# EAGLE design goodthopter10 (EAGLE 6.1)
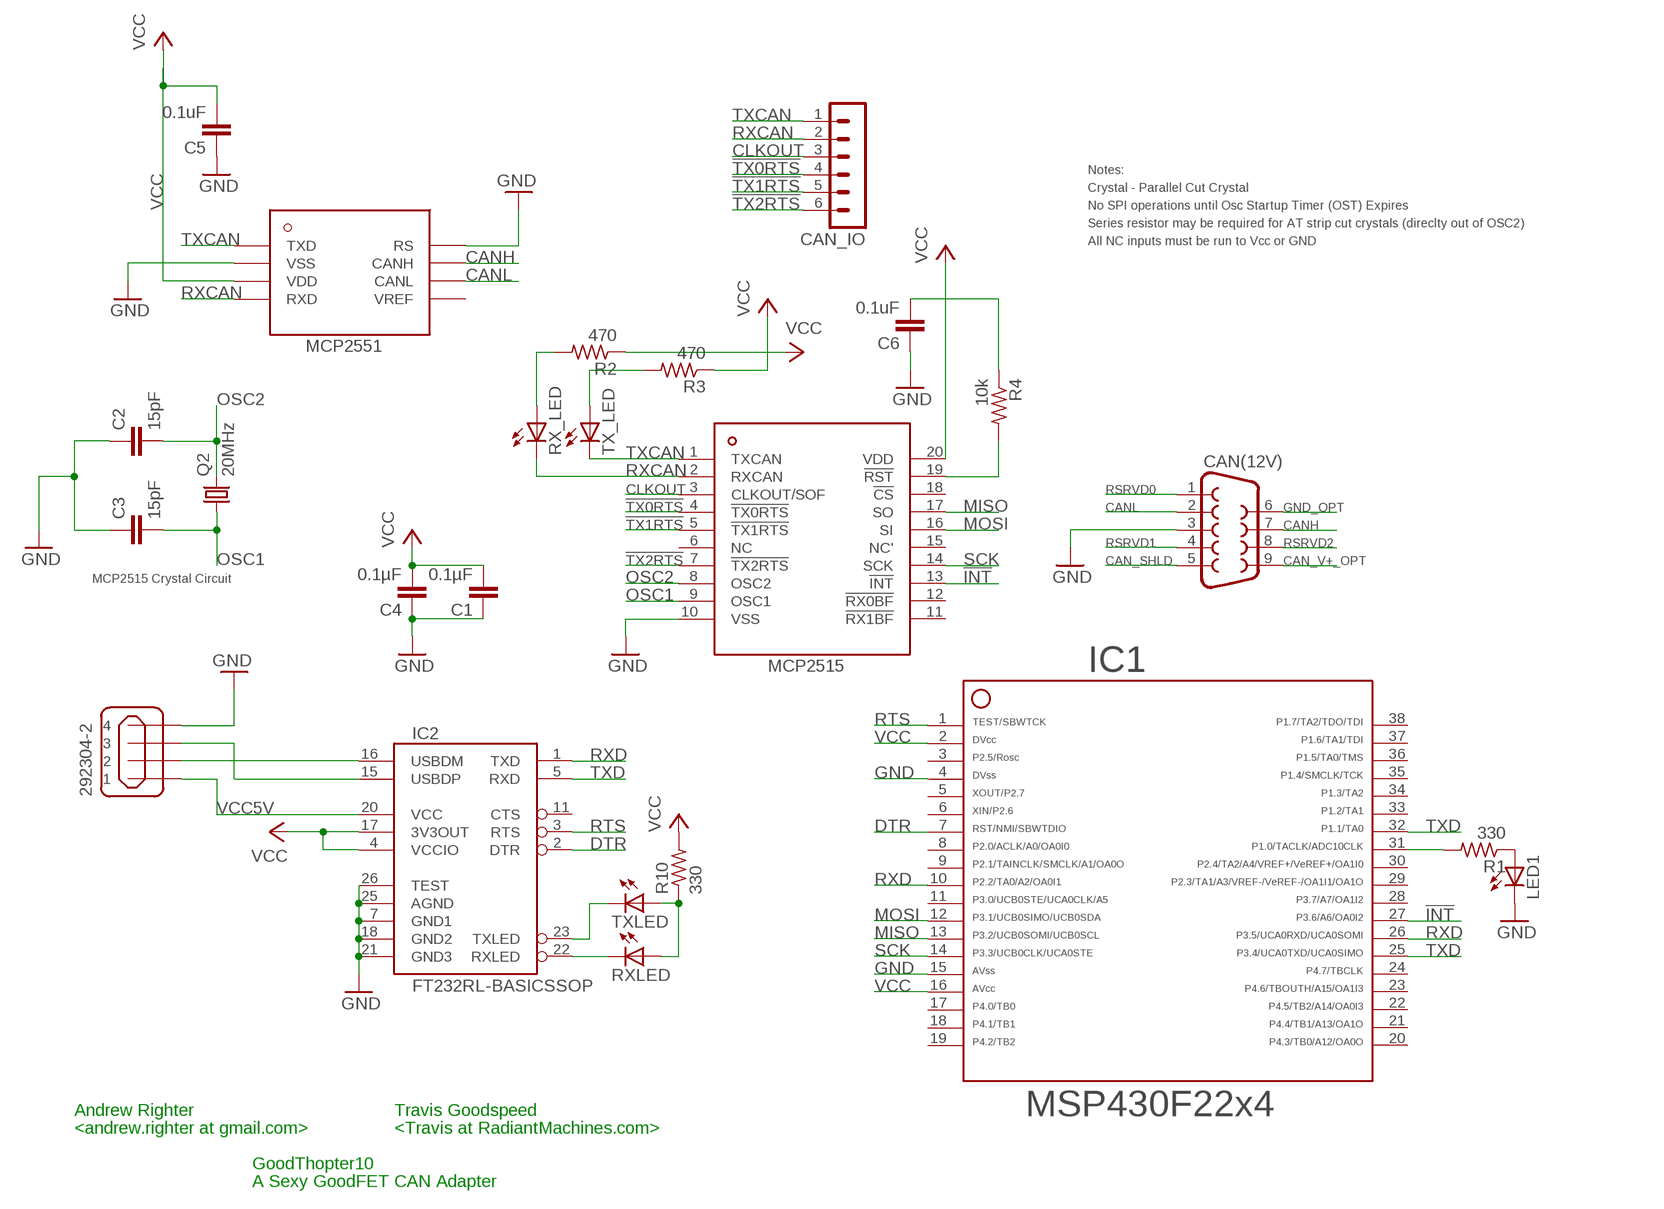
[diagram p0: schematic, sheet 1]

## Parts
292304-2  MINI-USB_4P-292304-2  [85-32004-10X]
C1  0.1µF  C-EUC0603  [C0603]
C2  15pF  C-EUC0603  [C0603]
C3  15pF  C-EUC0603  [C0603]
C4  0.1µF  C-EUC0603  [C0603]
C5  0.1uF  C-EUC0603  [C0603]
C6  0.1uF  C-EUC0603  [C0603]
CAN(12V)  DB9MALE  [DB9_MALE]
CAN_IO  MA06-1  [MA06-1]
IC1  F22X4---DA38  [DA38]
IC2  FT232RL-BASICSSOP  [SSOP28DB]
LED1  LEDCHIP-LED0603  [CHIP-LED0603]
Q2  20MHz  CRYSTALHC49UP  [HC49UP]
R1  330  R-US_R0603  [R0603]
R2  470  R-US_R0603  [R0603]
R3  470  R-US_R0603  [R0603]
R4  10k  R-US_R0603  [R0603]
R10  330  R-US_R0603  [R0603]
RX_LED  LEDCHIP-LED0603  [CHIP-LED0603]
RXLED  LEDCHIP-LED0603  [CHIP-LED0603]
TX_LED  LEDCHIP-LED0603  [CHIP-LED0603]
TXLED  LEDCHIP-LED0603  [CHIP-LED0603]
U$1  MCP2515  [TSSOP20]
U$2  MCP2551  [SOIC-8]

## Nets
!INT: IC1.27 U$1.13(!INT)
!TX0RTS: CAN_IO.4 U$1.4(!TX0RTS)
!TX1RTS: CAN_IO.5 U$1.5(!TX1RTS)
!TX2RTS: CAN_IO.6 U$1.7(!TX2RTS)
CAN_SHLD: CAN(12V).5
CAN_V+_OPT: CAN(12V).9
CANH: CAN(12V).7 U$2.CANH
CANL: CAN(12V).2 U$2.CANL
CLKOUT: CAN_IO.3 U$1.3(CLKOUT/SOF)
DTR: IC1.7 IC2.2(DTR)
GND: 292304-2.4 C1.1 C2.1 C3.1 C4.1 C5.1 C6.1 CAN(12V).3 IC1.4 IC1.15 IC2.7(GND1) IC2.18(GND2) IC2.21(GND3) IC2.25(AGND) IC2.26(TEST) LED1.C U$1.10(VSS) U$2.RS U$2.VSS
GND_OPT: CAN(12V).6
MISO: IC1.13 U$1.17(SO)
MOSI: IC1.12 U$1.16(SI)
N$1: R2.2 RX_LED.A
N$2: R3.2 TX_LED.A
N$3: 292304-2.3 IC2.15(USBDP)
N$4: 292304-2.2 IC2.16(USBDM)
N$5: R4.2 U$1.19(!RST)
N$6: IC2.22(RXLED) RXLED.C
N$7: IC2.23(TXLED) TXLED.C
N$8: R10.1 RXLED.A TXLED.A
N$9: IC1.31 R1.2
N$10: LED1.A R1.1
N$11: C6.2 R4.1
OSC1: C3.2 Q2.1 U$1.9(OSC1)
OSC2: C2.2 Q2.2 U$1.8(OSC2)
RSRVD0: CAN(12V).1
RSRVD1: CAN(12V).4
RSRVD2: CAN(12V).8
RTS: IC1.1 IC2.3(RTS)
RXCAN: CAN_IO.2 RX_LED.C U$1.2(RXCAN) U$2.RXD
RXD: IC1.10 IC1.26 IC2.1(TXD)
SCK: IC1.14 U$1.14(SCK)
TXCAN: CAN_IO.1 TX_LED.C U$1.1(TXCAN) U$2.TXD
TXD: IC1.25 IC1.32 IC2.5(RXD)
VCC: C1.2 C4.2 C5.2 IC1.2 IC1.16 IC2.4(VCCIO) IC2.17(3V3OUT) R2.1 R3.1 R10.2 U$1.20(VDD) U$2.VDD
VCC5V: 292304-2.1 IC2.20(VCC)
Unconnected: IC1.3 IC1.5 IC1.6 IC1.8 IC1.9 IC1.11 IC1.17 IC1.18 IC1.19 IC1.20 IC1.21 IC1.22 IC1.23 IC1.24 IC1.28 IC1.29 IC1.30 IC1.33 IC1.34 IC1.35 IC1.36 IC1.37 IC1.38 IC2.11(CTS) U$1.6(NC) U$1.11(!RX1BF) U$1.12(!RX0BF) U$1.15(NC') U$1.18(!CS) U$2.VREF

## Notes on the sheet
- Notes:
- Crystal - Parallel Cut Crystal
- No SPI operations until Osc Startup Timer (OST) Expires
- Series resistor may be required for AT strip cut crystals (direclty out of OSC2)
- All NC inputs must be run to Vcc or GND
- MCP2515 Crystal Circuit
- 292304-2
- Andrew Righter | Travis Goodspeed
- <andrew.righter at gmail.com> | <Travis at RadiantMachines.com>
- GoodThopter10
- A Sexy GoodFET CAN Adapter

## Library data of the parts
292304-2 = USB-TYPE-B:MINI-USB_4P-: MINI USB 4 Pol. Source: www.cypressindustries.com; OC_FARNELL: unknown; OC_NEWARK: unknown
C1-C6 = rcl:C-EU: CAPACITOR, European symbol
CAN(12V) = SparkFun-Connectors:DB9: DB9 Connector Standard DB9 (D-Sub 9) serial connector. Can be used for CAN bus as well as RS485 and RS232. Footprint production proven. Spark Fun Electronics SKU : PRT-00429
CAN_IO = con-lstb:MA06-1: PIN HEADER; OC_FARNELL: unknown; OC_NEWARK: unknown
IC1 = TI_MSP430_v13:F22X4---DA38: ***MSP430F22x4***DA38
IC2 = SparkFun:FT232RL-BASIC: USB UART This is the simplified version of the FT232RL unit. Only what you need, nothing you don't. Spark Fun Electronics SKU : COM-00650
LED1 RX_LED RXLED TX_LED TXLED = led:LED: LED OSRAM: - CHIPLED LG R971, LG N971, LY N971, LG Q971, LY Q971, LO R971, LY R971 LH N974, LH R974 LS Q976, LO Q976, LY Q976 LO Q996 - Hyper CHIPLED LW Q18S LB Q993, LB Q99A, LB R99A - SideLED LS A670, LO A670, LY A670, LG A670, LP A670 LB A673, LV A673, LT A673, LW A673 LH A674 LY A675 LS A676, LA A676, LO A676, LY A676, LW A676 LS A679, LY A679, LG A679 - Hyper Micro SIDELED® LS Y876, LA Y876, LO Y876, LY Y876 LT Y87S - SmartLED LW L88C, LW L88S LB L89C, LB L89S, LG L890 LS L89K, LO L89K, LY L89K LS L896, LA L896, LO L896, LY L896 - TOPLED LS T670, LO T670, LY T670, LG T670, LP T670 LSG T670, LSP T670, LSY T670, LOP T670, LYG T670 LG T671, LOG T671, LSG T671 LB T673, LV T673, LT T673, LW T673 LH T674 LS T676, LA T676, LO T676, LY T676, LB T676, LH T676, LSB T676, LW T676 LB T67C, LV T67C, LT T67C, LS T67K, LO T67K, LY T67K, LW E67C LS E67B, LA E67B, LO E67B, LY E67B, LB E67C, LV E67C, LT E67C LW T67C LS T679, LY T679, LG T679 LS T770, LO T770, LY T770, LG T770, LP T770 LB T773, LV T773, LT T773, LW T773 LH T774 LS E675, LA E675, LY E675, LS T675 LS T776, LA T776, LO T776, LY T776, LB T776 LHGB T686 LT T68C, LB T68C - Hyper Mini TOPLED® LB M676 - Mini TOPLED Santana® LG M470 LS M47K, LO M47K, LY M47K Source: http://www.osram.convergy.de LUXEON: - LUMILED® LXK2-PW12-R00, LXK2-PW12-S00, LXK2-PW14-U00, LXK2-PW14-V00 LXK2-PM12-R00, LXK2-PM12-S00, LXK2-PM14-U00 LXK2-PE12-Q00, LXK2-PE12-R00, LXK2-PE12-S00, LXK2-PE14-T00, LXK2-PE14-U00 LXK2-PB12-K00, LXK2-PB12-L00, LXK2-PB12-M00, LXK2-PB14-N00, LXK2-PB14-P00, LXK2-PB14-Q00 LXK2-PR12-L00, LXK2-PR12-M00, LXK2-PR14-Q00, LXK2-PR14-R00 LXK2-PD12-Q00, LXK2-PD12-R00, LXK2-PD12-S00 LXK2-PH12-R00, LXK2-PH12-S00 LXK2-PL12-P00, LXK2-PL12-Q00, LXK2-PL12-R00 Source: www.luxeon.com KINGBRIGHT: KA-3528ASYC Source: www.kingbright.com
Q2 = crystal:CRYSTAL: CRYSTAL; OC_FARNELL: unknown; OC_NEWARK: unknown
R1-R4 R10 = rcl:R-US_: RESISTOR, American symbol
U$1 = MCP2515:MCP2515: Microchip Technology’s MCP2515 is a stand-alone Controller Area Network (CAN) controller that implements the CAN specification, version 2.0B. It is capable of transmitting and receiving both standard and extended data and remote frames. The MCP2515 has two acceptance masks and six acceptance filters that are used to filter out unwanted messages, thereby reducing the host MCUs overhead. The MCP2515 interfaces with microcontrollers (MCUs) via an industry standard Serial Peripheral Interface (SPI).
U$2 = MCP2551:MCP2551: The MCP2551 is a high-speed CAN, fault-tolerant device that serves as the interface between a CAN protocol controller and the physical bus. The MCP2551 provides differential transmit and receive capability for the CAN protocol controller and is fully compatible with the ISO-11898 standard, including 24V requirements. It will operate at speeds of up to 1 Mb/s. Typically, each node in a CAN system must have a device to convert the digital signals generated by a CAN controller to signals suitable for transmission over the bus cabling (differential output). It also provides a buffer between the CAN controller and the high-voltage spikes that can be generated on the CAN bus by outside sources (EMI, ESD, electrical transients, etc.).

## Board
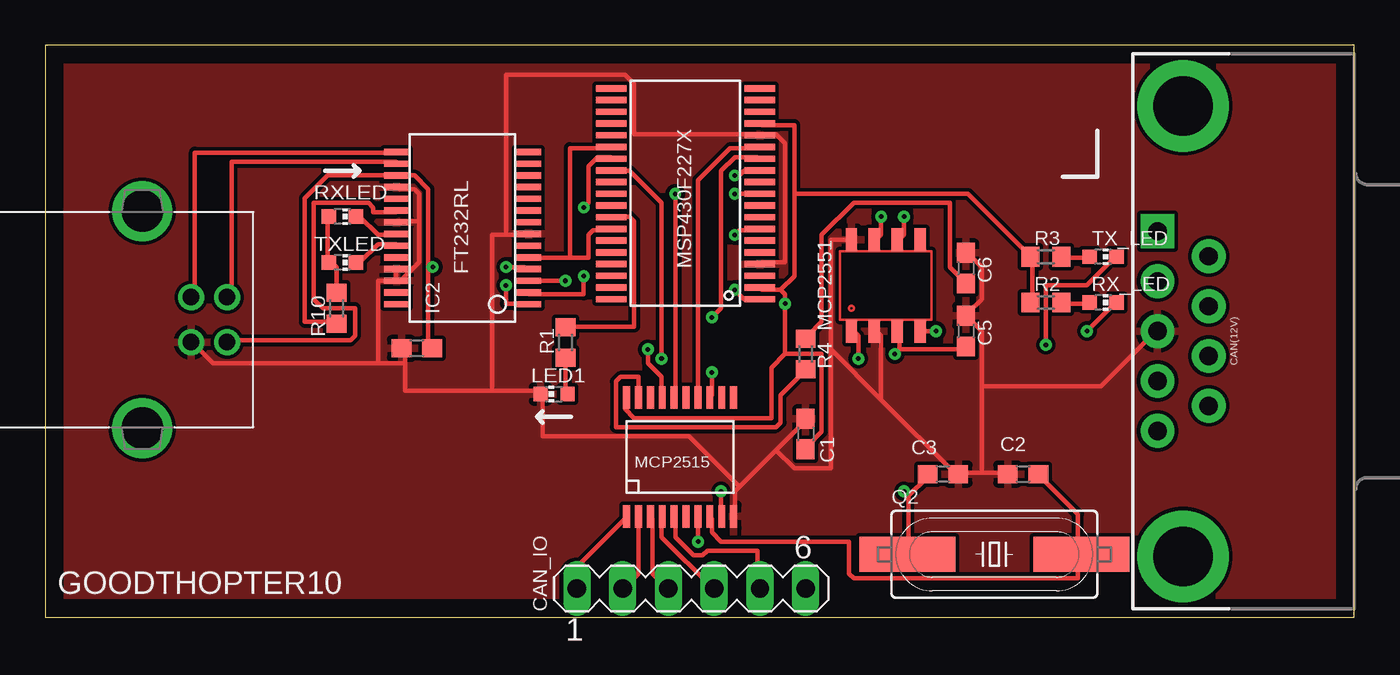
[diagram p1: board, top side]
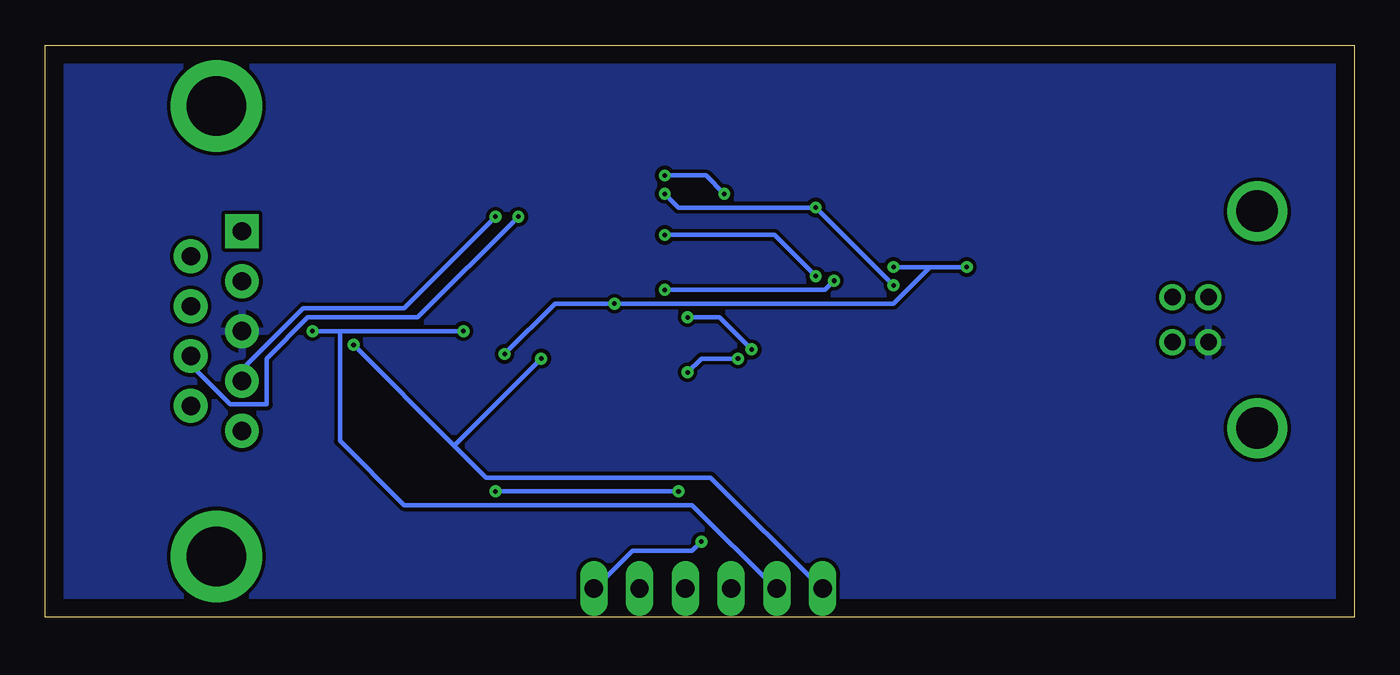
[diagram p2: board, bottom side, seen from below]

Size 72.69 x 31.75 mm. Coordinates in mm from the lower left corner, seen from the top.
Outline: 0,0 72.69,0 72.69,31.75 0,31.75 0,0
Copper layers (1*16): Top 0.035mm / dielectric 1.5mm / Bottom 0.035mm
Design rules: minimum track width 10mil, minimum drill 10mil, track to track 8mil, track to pad 8mil, pad to pad 8mil, via to via 8mil, smd to smd 8mil, copper to edge 40mil, drill to drill 10mil, minimum pad ring 10mil, minimum via ring 8mil, stop-mask expansion 4mil, vias tented up to drill 0mil, thermal gap 10mil

### Footprints (pad centres in the part's own frame; a part is rotated, then mirrored left to right if it is on the bottom)
85-32004-10X = drill 0.92 pad 1.27: 1 4.71,-1.25; 2 4.71,1.25; 3 2.71,1.25; 4 2.71,-1.25 | drill 2.3 pad 3: M1 0,6.02; M2 0,-6.02
C0603 = smd 1.1 x 1: 1 -0.85,0; 2 0.85,0
DB9_MALE = drill 1.016 pad 1.88: 1 5.54,-1.42; 2 2.77,-1.42; 3 0,-1.42; 4 -2.77,-1.42; 6 4.15,1.42; 7 1.38,1.42; 8 -1.38,1.42; 9 -4.15,1.42 | drill 1.016 pad 1.88 square: 5 -5.54,-1.42 | drill 3.302 pad 5.08: G1 -12.5,0; G2 12.5,0
MA06-1 = drill 1.016 long: 1 -6.35,0; 2 -3.81,0; 3 -1.27,0; 4 1.27,0; 5 3.81,0; 6 6.35,0
DA38 = smd 0.35 x 1.705: 1 -5.85,-4.12; 2 -5.2,-4.12; 3 -4.55,-4.12; 4 -3.9,-4.12; 5 -3.25,-4.12; 6 -2.6,-4.12; 7 -1.95,-4.12; 8 -1.3,-4.12; 9 -0.65,-4.12; 10 0,-4.12; 11 0.65,-4.12; 12 1.3,-4.12; 13 1.95,-4.12; 14 2.6,-4.12; 15 3.25,-4.12; 16 3.9,-4.12; 17 4.55,-4.12; 18 5.2,-4.12; 19 5.85,-4.12; 20 5.85,4.12; 21 5.2,4.12; 22 4.55,4.12; 23 3.9,4.12; 24 3.25,4.12; 25 2.6,4.12; 26 1.95,4.12; 27 1.3,4.12; 28 0.65,4.12; 29 0,4.12; 30 -0.65,4.12; 31 -1.3,4.12; 32 -1.95,4.12; 33 -2.6,4.12; 34 -3.25,4.12; 35 -3.9,4.12; 36 -4.55,4.12; 37 -5.2,4.12; 38 -5.85,4.12
SSOP28DB = smd 0.348 x 1.397: 1 -4.225,-3.656; 2 -3.575,-3.656; 3 -2.925,-3.656; 4 -2.275,-3.656; 5 -1.625,-3.656; 6 -0.975,-3.656; 7 -0.325,-3.656; 8 0.325,-3.656; 9 0.975,-3.656; 10 1.625,-3.656; 11 2.275,-3.656; 12 2.925,-3.656; 13 3.575,-3.656; 14 4.225,-3.656; 15 4.225,3.656; 16 3.575,3.656; 17 2.925,3.656; 18 2.275,3.656; 19 1.625,3.656; 20 0.975,3.656; 21 0.325,3.656; 22 -0.325,3.656; 23 -0.975,3.656; 24 -1.625,3.656; 25 -2.275,3.656; 26 -2.925,3.656; 27 -3.575,3.656; 28 -4.225,3.656
CHIP-LED0603 = smd 0.8 x 0.8: A 0,-0.75; C 0,0.75
HC49UP = smd 5.334 x 1.93: 1 -4.826,0; 2 4.826,0
R0603 = smd 1 x 1.1: 1 -0.85,0; 2 0.85,0
TSSOP20 = smd 1.27 x 0.381: 1 -3.302,2.642; 2 -3.302,1.981; 3 -3.302,1.321; 4 -3.302,0.66; 5 -3.302,0; 6 -3.302,-0.66; 7 -3.302,-1.321; 8 -3.302,-1.981; 9 -3.302,-2.642; 10 -3.302,-3.302; 11 3.302,-3.302; 12 3.302,-2.642; 13 3.302,-1.981; 14 3.302,-1.321; 15 3.302,-0.66; 16 3.302,0; 17 3.302,0.66; 18 3.302,1.321; 19 3.302,1.981; 20 3.302,2.642
SOIC-8 = smd 1.27 x 0.635: CANH 2.54,0.635; CANL 2.54,-0.635; RS 2.54,1.905; RXD -2.54,-1.905; TXD -2.54,1.905; VDD -2.54,-0.635; VREF 2.54,-1.905; VSS -2.54,0.635

### Placement (x,y rotation side)
292304-2  5.4,16.51 0 top
C1  42.23,10.16 270 top
C2  54.29,7.94 0 top
C3  49.85,7.94 180 top
C4  20.64,14.92 0 top
C5  51.12,15.88 270 top
C6  51.12,19.37 270 top
CAN(12V)  63.18,15.88 270 top
CAN_IO  35.88,1.59 0 top
IC1  35.56,23.5 90 top
IC2  23.18,21.59 90 top
LED1  28.26,12.38 90 top
Q2  52.7,3.49 0 top
R1  28.89,15.24 90 top
R2  55.56,17.46 0 top
R3  55.56,20 0 top
R4  42.23,14.61 270 top
R10  16.19,17.14 270 top
RX_LED  58.74,17.46 270 top
RXLED  16.51,22.23 270 top
TX_LED  58.74,20 270 top
TXLED  16.51,19.68 270 top
U$1  34.92,8.89 90 top
U$2  46.67,18.41 90 top

### Tracks (layer width: path | path; a pad name or v marks a point on that pad's centre or on a via)
!INT  (via drill 0.25)
  Top 0.254: v37.02,13.59 37.02,12.32 U$1.13 | v34.23,14.35 34.23,22.99 32.45,24.77 31.69,24.77 IC1.27
  Bottom 0.254: v37.02,13.59 36.26,14.35 v34.23,14.35
!TX0RTS
  Top 0.254: U$1.4 34.23,5.46 34.23,4.45 37.02,1.65 CAN_IO.4
!TX1RTS
  Top 0.254: U$1.5 34.99,5.46 34.99,4.45 36.01,3.43 36.51,3.43 36.77,3.68 39.56,3.68 39.56,1.65 CAN_IO.5
!TX2RTS  (via drill 0.25)
  Top 0.254: v36.26,4.19 36.26,5.46 U$1.7
  Bottom 0.254: v36.26,4.19 36.77,3.68 40.07,3.68 42.1,1.65 CAN_IO.6
CANH  (via drill 0.25)
  Top 0.254: v46.42,22.23 46.42,21.21 46.16,20.95 U$2.CANH
  Bottom 0.254: v46.42,22.23 52.01,16.64 58.1,16.64 60.39,14.35 60.39,11.81 62.42,11.81 64.45,13.84 64.45,14.35 CAN(12V).7
CANL  (via drill 0.25)
  Top 0.254: v47.69,22.23 47.69,21.21 47.43,20.95 U$2.CANL
  Bottom 0.254: v47.69,22.23 52.77,17.14 58.36,17.14 61.66,13.84 61.66,13.34 CAN(12V).2
CLKOUT
  Top 0.254: U$1.3 33.72,5.46 33.72,2.41 34.48,1.65 CAN_IO.3
DTR  (via drill 0.25)
  Top 0.254: v29.91,18.92 29.91,17.91 26.86,17.91 IC2.2 | v38.29,21.21 38.54,21.46 39.56,21.46 IC1.7
  Bottom 0.254: v29.91,18.92 32.19,21.21 v38.29,21.21
GND
  Top 0.254: 38.54,7.24 38.29,6.99 38.29,5.71 U$1.10 | 38.54,7.24 40.58,9.27 | 40.58,9.27 42.1,10.79 C1.1 | C6.1 51.24,20.19 52.01,19.43 52.01,17.65 51.24,16.89 C5.1 51.24,16.64 52.01,15.88 52.01,12.83 | 52.01,8 53.28,8 C2.1 | 52.01,8 50.74,8 C3.1 50.48,8 46.42,12.06 | 46.42,12.06 46.42,15.62 46.16,15.88 U$2.VSS | U$2.RS 43.62,20.95 43.62,14.86 | 46.42,12.06 43.62,14.86 | 52.01,8 52.01,12.83 | 52.01,12.83 58.61,12.83 61.66,15.88 CAN(12V).3 | 40.58,9.27 41.59,8.26 43.62,8.26 43.62,14.86 | IC1.4 39.81,19.68 41.08,19.68 41.08,26.29 40.58,26.8 39.81,26.8 IC1.15 39.56,26.8 32.7,26.8 32.7,29.59 32.19,30.1 25.59,30.1 25.59,21.21 | 19.49,18.67 19.49,19.18 IC2.25 | 20.77,21.97 19.75,21.97 IC2.21 | 20.77,21.97 20.77,19.68 19.75,18.67 IC2.26 19.49,18.67 | 20.77,21.97 20.77,23.5 20.51,23.75 19.75,23.75 IC2.18 | 24.83,12.57 20,12.57 20,14.1 | 24.83,12.57 27.37,12.57 LED1.C 27.62,12.32 27.62,10.03 35.75,10.03 38.54,7.24 | 20,14.1 20,14.86 C4.1 | 25.59,21.21 24.83,21.21 24.83,12.57 | 25.59,21.21 26.61,21.21 IC2.7 | 20,14.1 18.48,14.1 | 18.48,14.1 9.34,14.1 8.32,15.11 292304-2.4 | 19.49,18.67 18.48,18.67 18.48,14.1
  pour Top: 0,31.75 72.71,31.75 72.71,0 0,0
  pour Bottom: 0,31.75 72.71,31.75 72.71,-0.32 0,-0.32
MISO  (via drill 0.25)
  Top 0.254: v33.47,14.86 33.47,14.1 34.23,13.34 34.23,12.32 U$1.17 | v37.02,16.64 37.53,17.14 37.53,24.77 38.29,25.53 39.56,25.53 IC1.13
  Bottom 0.254: v33.47,14.86 35.24,16.64 v37.02,16.64
MOSI  (via drill 0.25)
  Top 0.254: v34.99,23.5 34.99,12.32 U$1.16 | v38.29,24.51 38.54,24.51 38.8,24.77 39.56,24.77 IC1.12
  Bottom 0.254: v34.99,23.5 36.01,24.51 v38.29,24.51
N$1
  Top 0.254: RX_LED.A 57.85,17.4 56.58,17.4 R2.2
N$2
  Top 0.254: TX_LED.A 57.85,19.94 56.58,19.94 R3.2
N$3
  Top 0.254: IC2.15 19.49,25.78 8.32,25.78 8.32,17.91 292304-2.3
N$4
  Top 0.254: IC2.16 19.49,25.27 10.35,25.27 10.35,17.91 292304-2.2
N$5
  Top 0.254: R4.2 42.1,13.59 40.83,12.32 40.83,10.79 40.58,10.54 31.69,10.54 31.69,13.08 31.94,13.34 32.96,13.34 32.96,12.32 U$1.19
N$6
  Top 0.254: RXLED.C 17.46,22.23 18.48,21.21 19.49,21.21 IC2.22
N$7
  Top 0.254: TXLED.C 17.46,19.68 18.48,20.7 19.49,20.7 IC2.23
N$8
  Top 0.254: R10.1 16.19,19.43 15.94,19.68 TXLED.A 15.68,19.68 15.68,22.23 RXLED.A
N$9
  Top 0.254: R1.2 28.89,16.13 32.7,16.13 32.7,21.97 32.45,22.23 31.69,22.23 IC1.31
N$10
  Top 0.254: R1.1 28.89,12.57 LED1.A
N$11
  Top 0.254: R4.1 42.35,15.62 43.12,16.38 43.12,21.21 44.9,22.99 50.23,22.99 50.23,19.43 50.99,18.67 C6.2
OSC1  (via drill 0.25)
  Top 0.254: 47.94,6.73 48.96,7.75 C3.2 | 47.94,6.73 47.94,3.68 Q2.1 | v37.53,6.99 37.53,5.71 U$1.9 | 47.94,6.73 v47.69,6.99
  Bottom 0.254: v47.69,6.99 v37.53,6.99
OSC2
  Top 0.254: C2.2 55.31,7.75 57.34,5.71 57.34,3.68 Q2.2 57.34,3.43 57.34,2.16 44.9,2.16 44.64,2.41 44.64,4.19 37.53,4.19 37.02,4.7 37.02,5.46 U$1.8
RTS  (via drill 0.25)
  Top 0.254: v28.89,18.67 26.86,18.67 IC2.3 | v38.29,18.16 38.8,17.65 39.56,17.65 IC1.1
  Bottom 0.254: v28.89,18.67 29.4,18.16 v38.29,18.16
RXCAN  (via drill 0.25)
  Top 0.254: U$1.2 32.96,5.46 32.96,2.41 32.19,1.65 CAN_IO.2 | v57.85,15.88 59.37,17.4 RX_LED.C | U$2.RXD v49.47,15.88
  Bottom 0.254: v49.47,15.88 56.33,15.88 | 56.33,15.88 v57.85,15.88 | 56.33,15.88 56.33,9.78 52.77,6.22 36.77,6.22 32.19,1.65 CAN_IO.2
RXD  (via drill 0.25)
  Top 0.254: v25.59,18.41 25.59,17.4 26.61,17.4 IC2.1 | v29.91,22.73 30.16,22.99 30.16,25.02 30.67,25.53 31.43,25.53 IC1.26 | v38.29,23.5 IC1.10
  Bottom 0.254: v25.59,18.41 v29.91,22.73 37.53,22.73 v38.29,23.5
SCK
  Top 0.254: U$1.14 36.26,12.32 36.26,24.26 38.04,26.04 39.56,26.04 IC1.14
TXCAN  (via drill 0.25)
  Top 0.254: v55.56,15.11 55.56,18.41 57.85,18.41 59.37,19.94 TX_LED.C | U$1.1 32.19,5.46 29.65,2.92 29.65,1.65 CAN_IO.1 | v45.15,14.35 45.15,15.62 44.9,15.88 U$2.TXD
  Bottom 0.254: 49.97,9.53 48.2,7.75 35.75,7.75 29.65,1.65 CAN_IO.1 | 49.97,9.53 v55.56,15.11 | 49.97,9.53 v45.15,14.35
TXD
  Top 0.254: 29.15,19.94 30.16,19.94 30.16,21.21 30.42,21.46 31.43,21.46 IC1.32 | 29.15,19.94 26.86,19.94 IC2.5 | 29.15,19.94 29.15,26.04 31.43,26.04 IC1.25
VCC  (via drill 0.25)
  Top 0.254: R2.1 54.8,17.65 54.8,19.94 R3.1 54.55,20.19 51.24,23.5 41.59,23.5 | 41.08,14.61 43.12,14.61 43.12,10.29 42.35,9.53 C1.2 | 41.08,14.61 v41.08,17.4 41.08,17.91 40.83,18.16 | 40.83,18.16 39.81,18.16 IC1.2 | 41.08,14.61 40.32,13.84 40.32,11.05 32.7,11.05 32.19,11.56 32.19,12.06 U$1.20 | 41.59,23.5 41.59,18.92 40.83,18.16 | 41.59,23.5 41.59,27.3 39.81,27.3 IC1.16 | 47.43,14.86 50.99,14.86 C5.2 | 47.43,14.86 47.43,15.88 U$2.VDD | 21.27,19.43 21.27,23.75 20.51,24.51 19.75,24.51 IC2.17 19.49,24.51 15.68,24.51 14.41,23.24 14.41,16.38 16.19,16.38 R10.2 | 21.27,19.43 21.27,15.11 C4.2 | v25.59,19.43 26.61,19.43 IC2.4 | 21.27,19.43 v21.53,19.43 | v47.18,14.61 47.43,14.86
  Bottom 0.254: v21.53,19.43 23.56,19.43 | 23.56,19.43 v25.59,19.43 | v47.18,14.61 44.39,17.4 v41.08,17.4 25.59,17.4 23.56,19.43
VCC5V
  Top 0.254: IC2.20 19.49,22.48 18.22,22.48 18.22,22.73 17.97,22.99 14.92,22.99 14.92,17.65 15.43,17.14 17.21,17.14 17.21,15.62 16.95,15.37 10.35,15.37 292304-2.1

### Text on the board
tPlace: GOODTHOPTER10
tNames: FT232RL | MSP430F227X